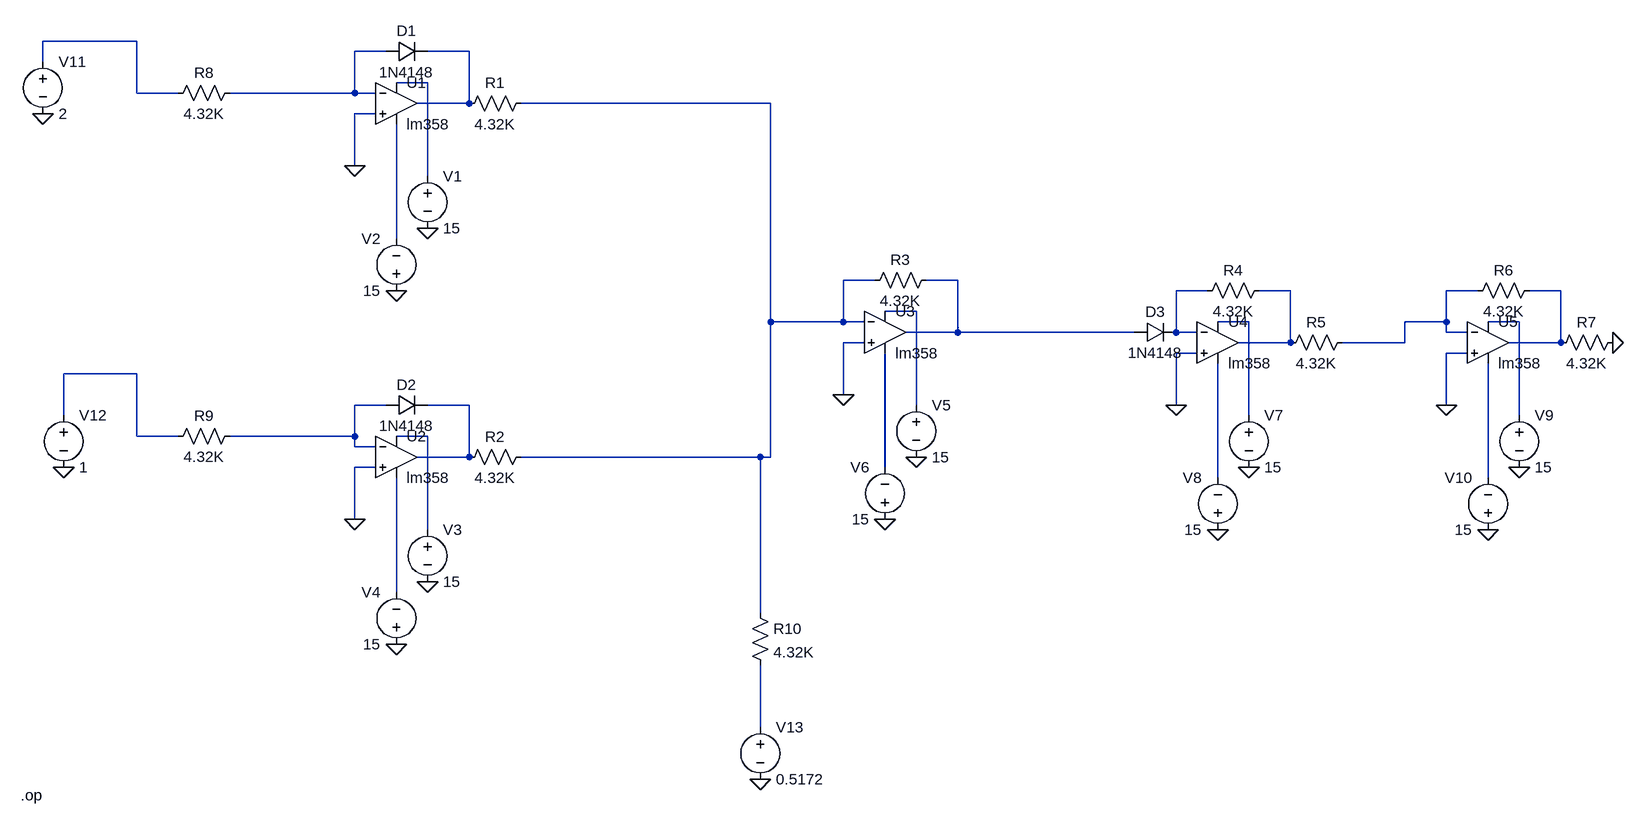
[diagram p0: schematic Multiplication.asc]
Multiplication.asc, the LTspice schematic file:
Version 4
SHEET 1 1976 1016
WIRE -624 -160 -768 -160
WIRE -240 -144 -288 -144
WIRE -112 -144 -176 -144
WIRE -768 -128 -768 -160
WIRE -176 -96 -224 -96
WIRE -624 -80 -624 -160
WIRE -560 -80 -624 -80
WIRE -288 -80 -288 -144
WIRE -288 -80 -480 -80
WIRE -256 -80 -288 -80
WIRE -112 -64 -112 -144
WIRE -112 -64 -192 -64
WIRE 352 -64 -32 -64
WIRE -256 -48 -288 -48
WIRE -288 32 -288 -48
WIRE -176 48 -176 -96
WIRE -224 144 -224 -32
WIRE 512 208 464 208
WIRE 640 208 592 208
WIRE 1024 224 976 224
WIRE 1152 224 1104 224
WIRE 1440 224 1392 224
WIRE 1568 224 1520 224
WIRE 576 256 528 256
WIRE 352 272 352 -64
WIRE 464 272 464 208
WIRE 464 272 352 272
WIRE 496 272 464 272
WIRE 1088 272 1040 272
WIRE 1392 272 1392 224
WIRE 1392 272 1328 272
WIRE 1504 272 1456 272
WIRE 640 288 640 208
WIRE 640 288 560 288
WIRE 912 288 640 288
WIRE 976 288 976 224
WIRE 1008 288 976 288
WIRE 1392 288 1392 272
WIRE 1424 288 1392 288
WIRE 496 304 464 304
WIRE 1152 304 1152 224
WIRE 1152 304 1072 304
WIRE 1328 304 1328 272
WIRE 1328 304 1232 304
WIRE 1568 304 1568 224
WIRE 1568 304 1488 304
WIRE 1008 320 976 320
WIRE 1424 320 1392 320
WIRE -624 352 -736 352
WIRE 464 384 464 304
WIRE -240 400 -288 400
WIRE -112 400 -176 400
WIRE 576 400 576 256
WIRE 976 400 976 320
WIRE 1392 400 1392 320
WIRE -736 416 -736 352
WIRE 1088 416 1088 272
WIRE 1504 416 1504 272
WIRE -624 448 -624 352
WIRE -560 448 -624 448
WIRE -288 448 -288 400
WIRE -288 448 -480 448
WIRE -176 448 -224 448
WIRE -288 464 -288 448
WIRE -256 464 -288 464
WIRE -112 480 -112 400
WIRE -112 480 -192 480
WIRE 336 480 -32 480
WIRE 352 480 352 272
WIRE 352 480 336 480
WIRE -256 496 -288 496
WIRE 528 496 528 320
WIRE 1040 512 1040 336
WIRE 1456 512 1456 336
WIRE -288 576 -288 496
WIRE -176 592 -176 448
WIRE -224 688 -224 512
WIRE 336 720 336 480
WIRE 336 896 336 800
FLAG -288 32 0
FLAG -224 224 0
FLAG -176 128 0
FLAG -288 576 0
FLAG -224 768 0
FLAG -176 672 0
FLAG 464 384 0
FLAG 528 576 0
FLAG 576 480 0
FLAG 976 400 0
FLAG 1040 592 0
FLAG 1088 496 0
FLAG 1392 400 0
FLAG 1456 592 0
FLAG 1504 496 0
FLAG 1648 304 0
FLAG -768 -48 0
FLAG -736 496 0
FLAG 336 976 0
SYMBOL OpAmps\\lm358 -224 -128 R0
SYMATTR InstName U1
SYMBOL voltage -176 32 R0
WINDOW 123 0 0 Left 0
WINDOW 39 0 0 Left 0
SYMATTR InstName V1
SYMATTR Value 15
SYMBOL res -16 -80 R90
WINDOW 0 0 56 VBottom 2
WINDOW 3 32 56 VTop 2
SYMATTR InstName R1
SYMATTR Value 4.32K
SYMATTR SpiceLine tol=1 pwr=0.1
SYMBOL voltage -224 240 R180
WINDOW 0 24 96 Left 2
WINDOW 3 24 16 Left 2
WINDOW 123 0 0 Left 0
WINDOW 39 0 0 Left 0
SYMATTR InstName V2
SYMATTR Value 15
SYMBOL diode -240 -128 R270
WINDOW 0 32 32 VTop 2
WINDOW 3 0 32 VBottom 2
SYMATTR InstName D1
SYMATTR Value 1N4148
SYMBOL OpAmps\\lm358 -224 416 R0
SYMATTR InstName U2
SYMBOL voltage -176 576 R0
WINDOW 123 0 0 Left 0
WINDOW 39 0 0 Left 0
SYMATTR InstName V3
SYMATTR Value 15
SYMBOL res -16 464 R90
WINDOW 0 0 56 VBottom 2
WINDOW 3 32 56 VTop 2
SYMATTR InstName R2
SYMATTR Value 4.32K
SYMATTR SpiceLine tol=1 pwr=0.1
SYMBOL voltage -224 784 R180
WINDOW 0 24 96 Left 2
WINDOW 3 24 16 Left 2
WINDOW 123 0 0 Left 0
WINDOW 39 0 0 Left 0
SYMATTR InstName V4
SYMATTR Value 15
SYMBOL diode -240 416 R270
WINDOW 0 32 32 VTop 2
WINDOW 3 0 32 VBottom 2
SYMATTR InstName D2
SYMATTR Value 1N4148
SYMBOL OpAmps\\lm358 528 224 R0
SYMATTR InstName U3
SYMBOL res 608 192 R90
WINDOW 0 0 56 VBottom 2
WINDOW 3 32 56 VTop 2
SYMATTR InstName R3
SYMATTR Value 4.32K
SYMATTR SpiceLine tol=1 pwr=0.1
SYMBOL voltage 576 384 R0
WINDOW 123 0 0 Left 0
WINDOW 39 0 0 Left 0
SYMATTR InstName V5
SYMATTR Value 15
SYMBOL voltage 528 592 R180
WINDOW 0 24 96 Left 2
WINDOW 3 24 16 Left 2
WINDOW 123 0 0 Left 0
WINDOW 39 0 0 Left 0
SYMATTR InstName V6
SYMATTR Value 15
SYMBOL OpAmps\\lm358 1040 240 R0
SYMATTR InstName U4
SYMBOL res 1120 208 R90
WINDOW 0 0 56 VBottom 2
WINDOW 3 32 56 VTop 2
SYMATTR InstName R4
SYMATTR Value 4.32K
SYMATTR SpiceLine tol=1 pwr=0.1
SYMBOL voltage 1088 400 R0
WINDOW 123 0 0 Left 0
WINDOW 39 0 0 Left 0
SYMATTR InstName V7
SYMATTR Value 15
SYMBOL voltage 1040 608 R180
WINDOW 0 24 96 Left 2
WINDOW 3 24 16 Left 2
WINDOW 123 0 0 Left 0
WINDOW 39 0 0 Left 0
SYMATTR InstName V8
SYMATTR Value 15
SYMBOL diode 912 304 R270
WINDOW 0 32 32 VTop 2
WINDOW 3 0 32 VBottom 2
SYMATTR InstName D3
SYMATTR Value 1N4148
SYMBOL res 1248 288 R90
WINDOW 0 0 56 VBottom 2
WINDOW 3 32 56 VTop 2
SYMATTR InstName R5
SYMATTR Value 4.32K
SYMATTR SpiceLine tol=1 pwr=0.1
SYMBOL OpAmps\\lm358 1456 240 R0
SYMATTR InstName U5
SYMBOL res 1536 208 R90
WINDOW 0 0 56 VBottom 2
WINDOW 3 32 56 VTop 2
SYMATTR InstName R6
SYMATTR Value 4.32K
SYMATTR SpiceLine tol=1 pwr=0.1
SYMBOL voltage 1504 400 R0
WINDOW 123 0 0 Left 0
WINDOW 39 0 0 Left 0
SYMATTR InstName V9
SYMATTR Value 15
SYMBOL voltage 1456 608 R180
WINDOW 0 24 96 Left 2
WINDOW 3 24 16 Left 2
WINDOW 123 0 0 Left 0
WINDOW 39 0 0 Left 0
SYMATTR InstName V10
SYMATTR Value 15
SYMBOL res 1664 288 R90
WINDOW 0 0 56 VBottom 2
WINDOW 3 32 56 VTop 2
SYMATTR InstName R7
SYMATTR Value 4.32K
SYMATTR SpiceLine tol=1 pwr=0.1
SYMBOL voltage -768 -144 R0
WINDOW 123 0 0 Left 0
WINDOW 39 0 0 Left 0
SYMATTR InstName V11
SYMATTR Value 2
SYMBOL voltage -736 400 R0
WINDOW 123 0 0 Left 0
WINDOW 39 0 0 Left 0
SYMATTR InstName V12
SYMATTR Value 1
SYMBOL res -464 -96 R90
WINDOW 0 0 56 VBottom 2
WINDOW 3 32 56 VTop 2
SYMATTR InstName R8
SYMATTR Value 4.32K
SYMATTR SpiceLine tol=1 pwr=0.1
SYMBOL res -464 432 R90
WINDOW 0 0 56 VBottom 2
WINDOW 3 32 56 VTop 2
SYMATTR InstName R9
SYMATTR Value 4.32K
SYMATTR SpiceLine tol=1 pwr=0.1
SYMBOL voltage 336 880 R0
WINDOW 123 0 0 Left 0
WINDOW 39 0 0 Left 0
SYMATTR InstName V13
SYMATTR Value 0.5172
SYMBOL res 320 704 R0
SYMATTR InstName R10
SYMATTR Value 4.32K
SYMATTR SpiceLine tol=1 pwr=0.1
TEXT -802 1000 Left 2 !.op

The netlist it stands for:
* Multiplication.asc
XU1 0 N002 N004 N006 N003 lm358  ; pins In+ In- V+ V- OUT
V1 N004 0 15
R1 N005 N003 4.32K tol=1 pwr=0.1
V2 0 N006 15
D1 N002 N003 1N4148
XU2 0 N016 N018 N022 N017 lm358  ; pins In+ In- V+ V- OUT
V3 N018 0 15
R2 N005 N017 4.32K tol=1 pwr=0.1
V4 0 N022 15
D2 N016 N017 1N4148
XU3 0 N005 N012 N019 N007 lm358  ; pins In+ In- V+ V- OUT
R3 N007 N005 4.32K tol=1 pwr=0.1
V5 N012 0 15
V6 0 N019 15
XU4 0 N008 N013 N020 N009 lm358  ; pins In+ In- V+ V- OUT
R4 N009 N008 4.32K tol=1 pwr=0.1
V7 N013 0 15
V8 0 N020 15
D3 N007 N008 1N4148
R5 N010 N009 4.32K tol=1 pwr=0.1
XU5 0 N010 N014 N021 N011 lm358  ; pins In+ In- V+ V- OUT
R6 N011 N010 4.32K tol=1 pwr=0.1
V9 N014 0 15
V10 0 N021 15
R7 0 N011 4.32K tol=1 pwr=0.1
V11 N001 0 2
V12 N015 0 1
R8 N002 N001 4.32K tol=1 pwr=0.1
R9 N016 N015 4.32K tol=1 pwr=0.1
V13 N023 0 0.5172
R10 N005 N023 4.32K tol=1 pwr=0.1
.model D D
.lib standard.dio
.op
.backanno
.end